# EAGLE design Shunt_Board_V1.0 (EAGLE 9.6.2)
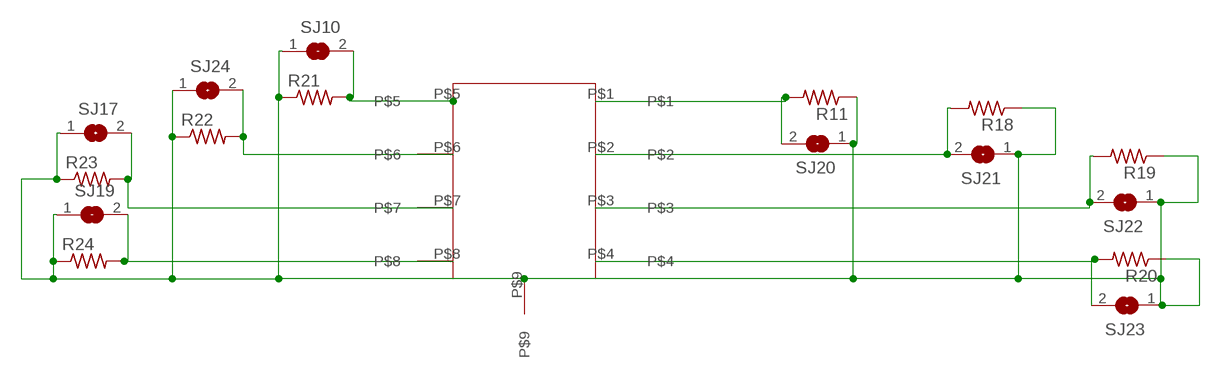
[diagram p0: schematic, sheet 1]

## Parts
R11  R-US_0204/5  [0204/5]
R18  R-US_0204/5  [0204/5]
R19  R-US_0204/5  [0204/5]
R20  R-US_0204/5  [0204/5]
R21  R-US_0204/5  [0204/5]
R22  R-US_0204/5  [0204/5]
R23  R-US_0204/5  [0204/5]
R24  R-US_0204/5  [0204/5]
SJ10  SJ  [SJ]
SJ17  SJ  [SJ]
SJ19  SJ  [SJ]
SJ20  SJ  [SJ]
SJ21  SJ  [SJ]
SJ22  SJ  [SJ]
SJ23  SJ  [SJ]
SJ24  SJ  [SJ]
U$1  SHUNT  [SHUNT]

## Nets
N$1: R11.1 R18.1 R19.1 R20.1 R21.1 R22.1 R23.1 R24.1 SJ10.1 SJ17.1 SJ19.1 SJ20.1 SJ21.1 SJ22.1 SJ23.1 SJ24.1 U$1.P$9
N$2: R21.2 SJ10.2 U$1.P$5
N$4: R22.2 SJ24.2 U$1.P$6
N$91: R18.2 SJ21.2 U$1.P$2
N$92: R19.2 SJ22.2 U$1.P$3
N$93: R20.2 SJ23.2 U$1.P$4
N$96: R23.2 SJ17.2 U$1.P$7
N$97: R24.2 SJ19.2 U$1.P$8
N$99: R11.2 SJ20.2 U$1.P$1

## Library data of the parts
R11 R18-R24 = rcl:R-US_: RESISTOR, American symbol; SPICEPREFIX: R
SJ10 SJ17 SJ19-SJ24 = jumper:SJ: SMD solder JUMPER
U$1 = Shunt_V1.0:SHUNT

## Net classes
0 default: width 0.15 mm
1 +5V: width 0.305 mm
2 GND: width 0.305 mm
3 +3.3V: width 0.305 mm
4 SCL: width 0.15 mm
5 SDA: width 0.15 mm

## Board
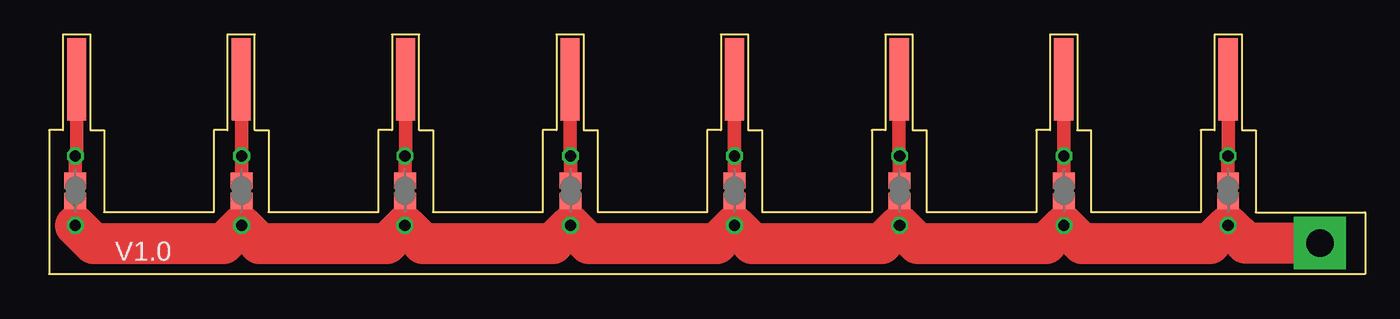
[diagram p1: board, top side]
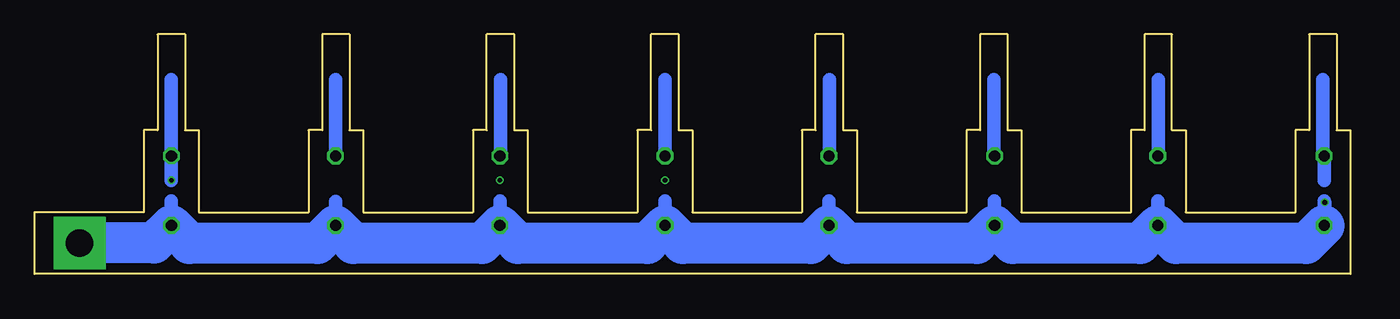
[diagram p2: board, bottom side, seen from below]

Size 96 x 17.5 mm. Coordinates in mm from the lower left corner, seen from the top.
Copper layers (1*16): Top 0.035mm / dielectric 1.5mm / Bottom 0.035mm
Design rules "default *": minimum track width 6mil, minimum drill 0.35mm, track to track 0.1mm, track to pad 0.1mm, pad to pad 6mil, via to via 6mil, smd to smd 6mil, copper to edge 0.1mm, drill to drill 6mil, minimum pad ring 0.1mm, minimum via ring 0.1mm, stop-mask expansion 4mil, vias tented up to drill 0mil, thermal gap 10mil

### Footprints (pad centres in the part's own frame; a part is rotated, then mirrored left to right if it is on the bottom)
0204/5 = drill 0.813 octagon: 1 -2.54,0; 2 2.54,0
SJ = smd 1.168 x 1.6: 1 -0.762,0; 2 0.762,0
SHUNT = smd 1.4 x 6: P$1 -85,-3.3; P$2 -73,-3.3; P$3 -61,-3.3; P$4 -49,-3.3; P$5 -37,-3.3; P$6 -25,-3.3; P$7 -13,-3.3; P$8 -1,-3.3 | drill 2 pad 3.81 square: P$9 5.692,-15.254

### Placement (x,y rotation side)
R11  1.91,6.07 90 top
R18  14.03,6.07 90 top
R19  25.95,6.07 90 top
R20  38.04,6.07 90 bottom
R21  49.99,6.07 90 top
R22  62.03,6.07 90 top
R23  74.03,6.07 90 top
R24  85.99,6.07 90 top
SJ10  49.99,6.07 90 top
SJ17  74.03,6.07 90 top
SJ19  85.99,6.07 90 top
SJ20  1.91,6.07 90 top
SJ21  14.03,6.07 90 top
SJ22  25.95,6.07 90 top
SJ23  38.04,6.07 90 top
SJ24  62.04,6.07 90 top
U$1  87,17.5 0 top

### Tracks (layer width: path | path; a pad name or v marks a point on that pad's centre or on a via)
N$1  (via drill 0.35)
  Top 1: R18.1 v14.03,3.54 SJ21.1 | R19.1 | R20.1 | R21.1 SJ10.1 | R23.1 SJ17.1 | SJ20.1 R11.1 | SJ22.1 R19.1 | SJ23.1 R20.1 | SJ24.1 v62.04,3.53 R22.1 | SJ19.1 v85.99,3.54 R24.1
  Top 3: R11.1 3.22,2.22 12.72,2.22 R18.1 15.35,2.22 24.63,2.22 R19.1 27.26,2.22 36.72,2.22 R20.1 39.35,2.22 48.68,2.22 R21.1 51.3,2.22 60.72,2.22 R22.1 63.35,2.22 72.72,2.22 R23.1 75.33,2.22 84.68,2.22 R24.1 87.28,2.25 U$1.P$9
  Bottom 1: v1.86,5.22 1.86,3.58 R11.1 SJ20.1 | SJ21.1 v14.03,3.54 | SJ22.1 R19.1 | SJ23.1 R20.1 | SJ10.1 R21.1 | SJ24.1 v62.04,3.53 | SJ17.1 R23.1 | SJ19.1 v85.99,3.54
  Bottom 3: R11.1 3.22,2.22 12.72,2.22 R18.1 15.35,2.22 24.63,2.22 R19.1 27.26,2.22 36.72,2.22 R20.1 39.35,2.22 48.68,2.22 R21.1 51.3,2.22 60.72,2.22 R22.1 63.35,2.22 72.72,2.22 R23.1 75.33,2.22 84.68,2.22 R24.1 87.28,2.25 U$1.P$9
  other vias: 74.03,3.53 49.99,3.53 38.04,3.53 25.95,3.53
N$2  (via drill 0.35)
  Top 1: SJ10.2 R21.2 50,8.62 U$1.P$5
  Bottom 1: U$1.P$5 50,8.62 R21.2
  other vias: 49.99,6.84
N$4  (via drill 0.35)
  Top 1: SJ24.2 v62.03,6.84 R22.2 62,8.65 U$1.P$6
  Bottom 1: U$1.P$6 62,8.65 R22.2
N$91
  Top 1: SJ21.2 R18.2 14.03,14.17 U$1.P$2
  Bottom 1: U$1.P$2 14,8.65 R18.2
N$92
  Top 1: U$1.P$3 26,8.67 R19.2 SJ22.2 | SJ22.2
  Bottom 1: U$1.P$3 26,8.67 R19.2
N$93
  Top 1: SJ23.2 | SJ23.2 R20.2 38,8.65 U$1.P$4
  Bottom 1: U$1.P$4 38,8.65 R20.2
N$96
  Top 1: U$1.P$7 74,8.63 R23.2 SJ17.2
  Bottom 1: U$1.P$7 74,8.63 R23.2
N$97  (via drill 0.35)
  Top 1: SJ19.2 R24.2 86,8.62 U$1.P$8
  Bottom 1: U$1.P$8 86,8.62 R24.2 | R24.2 | SJ19.2 R24.2
  other vias: 85.99,6.84
N$99
  Top 1: U$1.P$1 2,8.7 R11.2 SJ20.2
  Bottom 1: U$1.P$1 2,8.7 R11.2 SJ20.2

### Text on the board
tPlace: V1.0